# EAGLE schematic mysch (EAGLE 9.3.0)

## Sheet 1 of 3
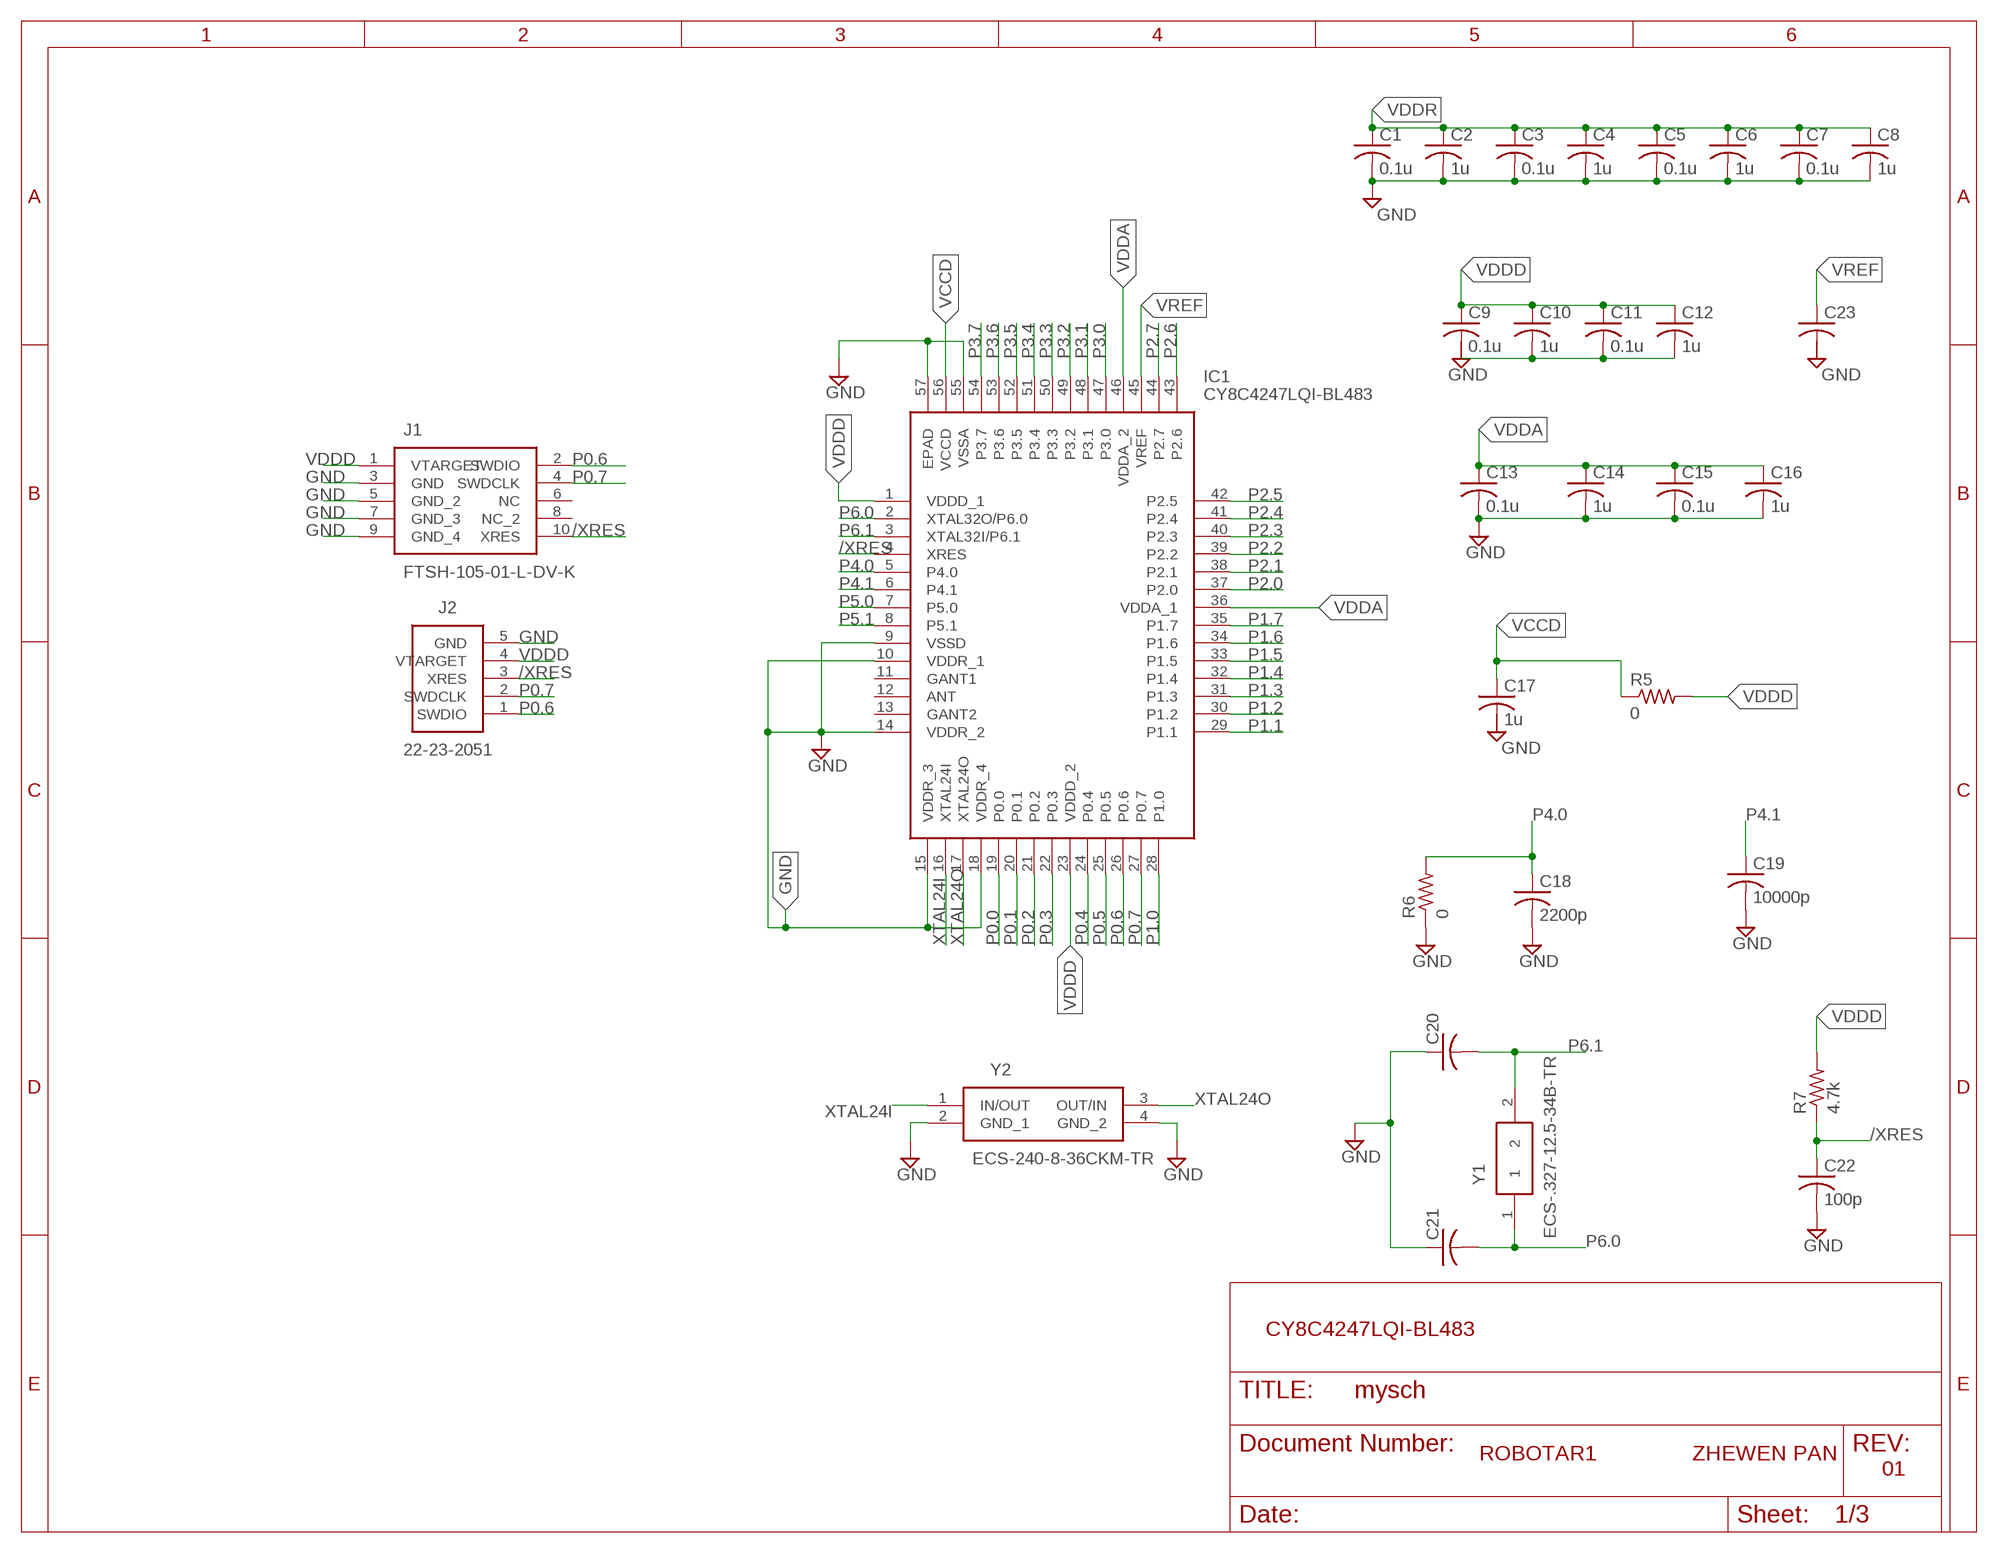
[diagram p0: schematic, sheet 1]

### Parts
C1  0.1u  C-USC0805  [C0805]
C2  1u  C-USC0805  [C0805]
C3  0.1u  C-USC0805  [C0805]
C4  1u  C-USC0805K  [C0805K]
C5  0.1u  C-USC0805  [C0805]
C6  1u  C-USC0805  [C0805]
C7  0.1u  C-USC0805  [C0805]
C8  1u  C-USC0805  [C0805]
C9  0.1u  C-USC0805K  [C0805K]
C10  1u  C-USC0805  [C0805]
C11  0.1u  C-USC0805  [C0805]
C12  1u  C-USC0805  [C0805]
C13  0.1u  C-USC0805  [C0805]
C14  1u  C-USC0805K  [C0805K]
C15  0.1u  C-USC0805K  [C0805K]
C16  1u  C-USC0805K  [C0805K]
C17  1u  C-USC0805  [C0805]
C18  2200p  C-USC0805  [C0805]
C19  10000p  C-USC0805  [C0805]
C20  C-USC0805  [C0805]
C21  C-USC0805  [C0805]
C22  100p  C-USC0805  [C0805]
C23  C-USC0805  [C0805]
IC1  CY8C4247LQI-BL483  [QFN40P700X700X60-57N]
J1  FTSH-105-01-L-DV-K  [FTSH-105-01-L-DV-K]
J2  22-23-2051  [HDRV5W64P0X254_1X5_1255X635X81]
R5  0  R-US_R0805  [R0805]
R6  0  R-US_R0805  [R0805]
R7  4.7k  R-US_R0805  [R0805]
Y1  ECS-.327-12.5-34B-TR  [ECX-31B]
Y2  ECS-240-8-36CKM-TR  [ECS240836QAESTR]

### Nets
/XRES: C22.1 IC1.4(XRES) J1.10(XRES) J2.3(XRES) R7.1
GND: C1.2 C2.2 C3.2 C4.2 C5.2 C6.2 C7.2 C8.2 C13.2 C14.2 C15.2 C16.2 C18.2 C19.2 C20.1 C21.1 C22.2 IC1.9(VSSD) IC1.10(VDDR_1) IC1.14(VDDR_2) IC1.15(VDDR_3) IC1.18(VDDR_4) IC1.55(VSSA) IC1.57(EPAD) J1.3(GND) J1.5(GND_2) J1.7(GND_3) J1.9(GND_4) J2.5(GND) R6.1 Y2.2(GND_1) Y2.4(GND_2) ; also sheet 2,3
N$10: C9.2 C10.2 C11.2 C12.2
P0.0: IC1.19(P0.0)
P0.1: IC1.20(P0.1)
P0.2: IC1.21(P0.2)
P0.3: IC1.22(P0.3)
P0.4: IC1.24(P0.4)
P0.5: IC1.25(P0.5)
P0.6: IC1.26(P0.6) J1.2(SWDIO) J2.1(SWDIO)
P0.7: IC1.27(P0.7) J1.4(SWDCLK) J2.2(SWDCLK)
P1.0: IC1.28(P1.0) ; also sheet 3
P1.1: IC1.29(P1.1) ; also sheet 3
P1.2: IC1.30(P1.2) ; also sheet 3
P1.3: IC1.31(P1.3)
P1.4: IC1.32(P1.4) ; also sheet 2
P1.5: IC1.33(P1.5) ; also sheet 2
P1.6: IC1.34(P1.6) ; also sheet 2
P1.7: IC1.35(P1.7)
P2.0: IC1.37(P2.0)
P2.1: IC1.38(P2.1)
P2.2: IC1.39(P2.2)
P2.3: IC1.40(P2.3)
P2.4: IC1.41(P2.4)
P2.5: IC1.42(P2.5)
P2.6: IC1.43(P2.6)
P2.7: IC1.44(P2.7)
P3.0: IC1.47(P3.0)
P3.1: IC1.48(P3.1)
P3.2: IC1.49(P3.2)
P3.3: IC1.50(P3.3)
P3.4: IC1.51(P3.4)
P3.5: IC1.52(P3.5)
P3.6: IC1.53(P3.6)
P3.7: IC1.54(P3.7)
P4.0: C18.1 IC1.5(P4.0) R6.2
P4.1: C19.1 IC1.6(P4.1)
P5.0: IC1.7(P5.0)
P5.1: IC1.8(P5.1)
P6.0: C21.2 IC1.2(XTAL32O/P6.0) Y1.1
P6.1: C20.2 IC1.3(XTAL32I/P6.1) Y1.2
VCCD: C17.1 IC1.56(VCCD) R5.1
VDDA: C13.1 C14.1 C15.1 C16.1 IC1.36(VDDA_1) IC1.46(VDDA_2)
VDDD: C9.1 C10.1 C11.1 C12.1 IC1.1(VDDD_1) IC1.23(VDDD_2) J1.1(VTARGET) J2.4(VTARGET) R5.2 R7.2
VDDR: C1.1 C2.1 C3.1 C4.1 C5.1 C6.1 C7.1 C8.1
VREF: C23.1 IC1.45(VREF)
XTAL24I: IC1.16(XTAL24I) Y2.1(IN/OUT)
XTAL24O: IC1.17(XTAL24O) Y2.3(OUT/IN)
Unconnected: C17.2 C23.2 IC1.11(GANT1) IC1.12(ANT) IC1.13(GANT2) J1.6(NC) J1.8(NC_2)

### Notes on the sheet
- CY8C4247LQI-BL483
- ROBOTAR1 | ZHEWEN PAN | 01

## Sheet 2 of 3
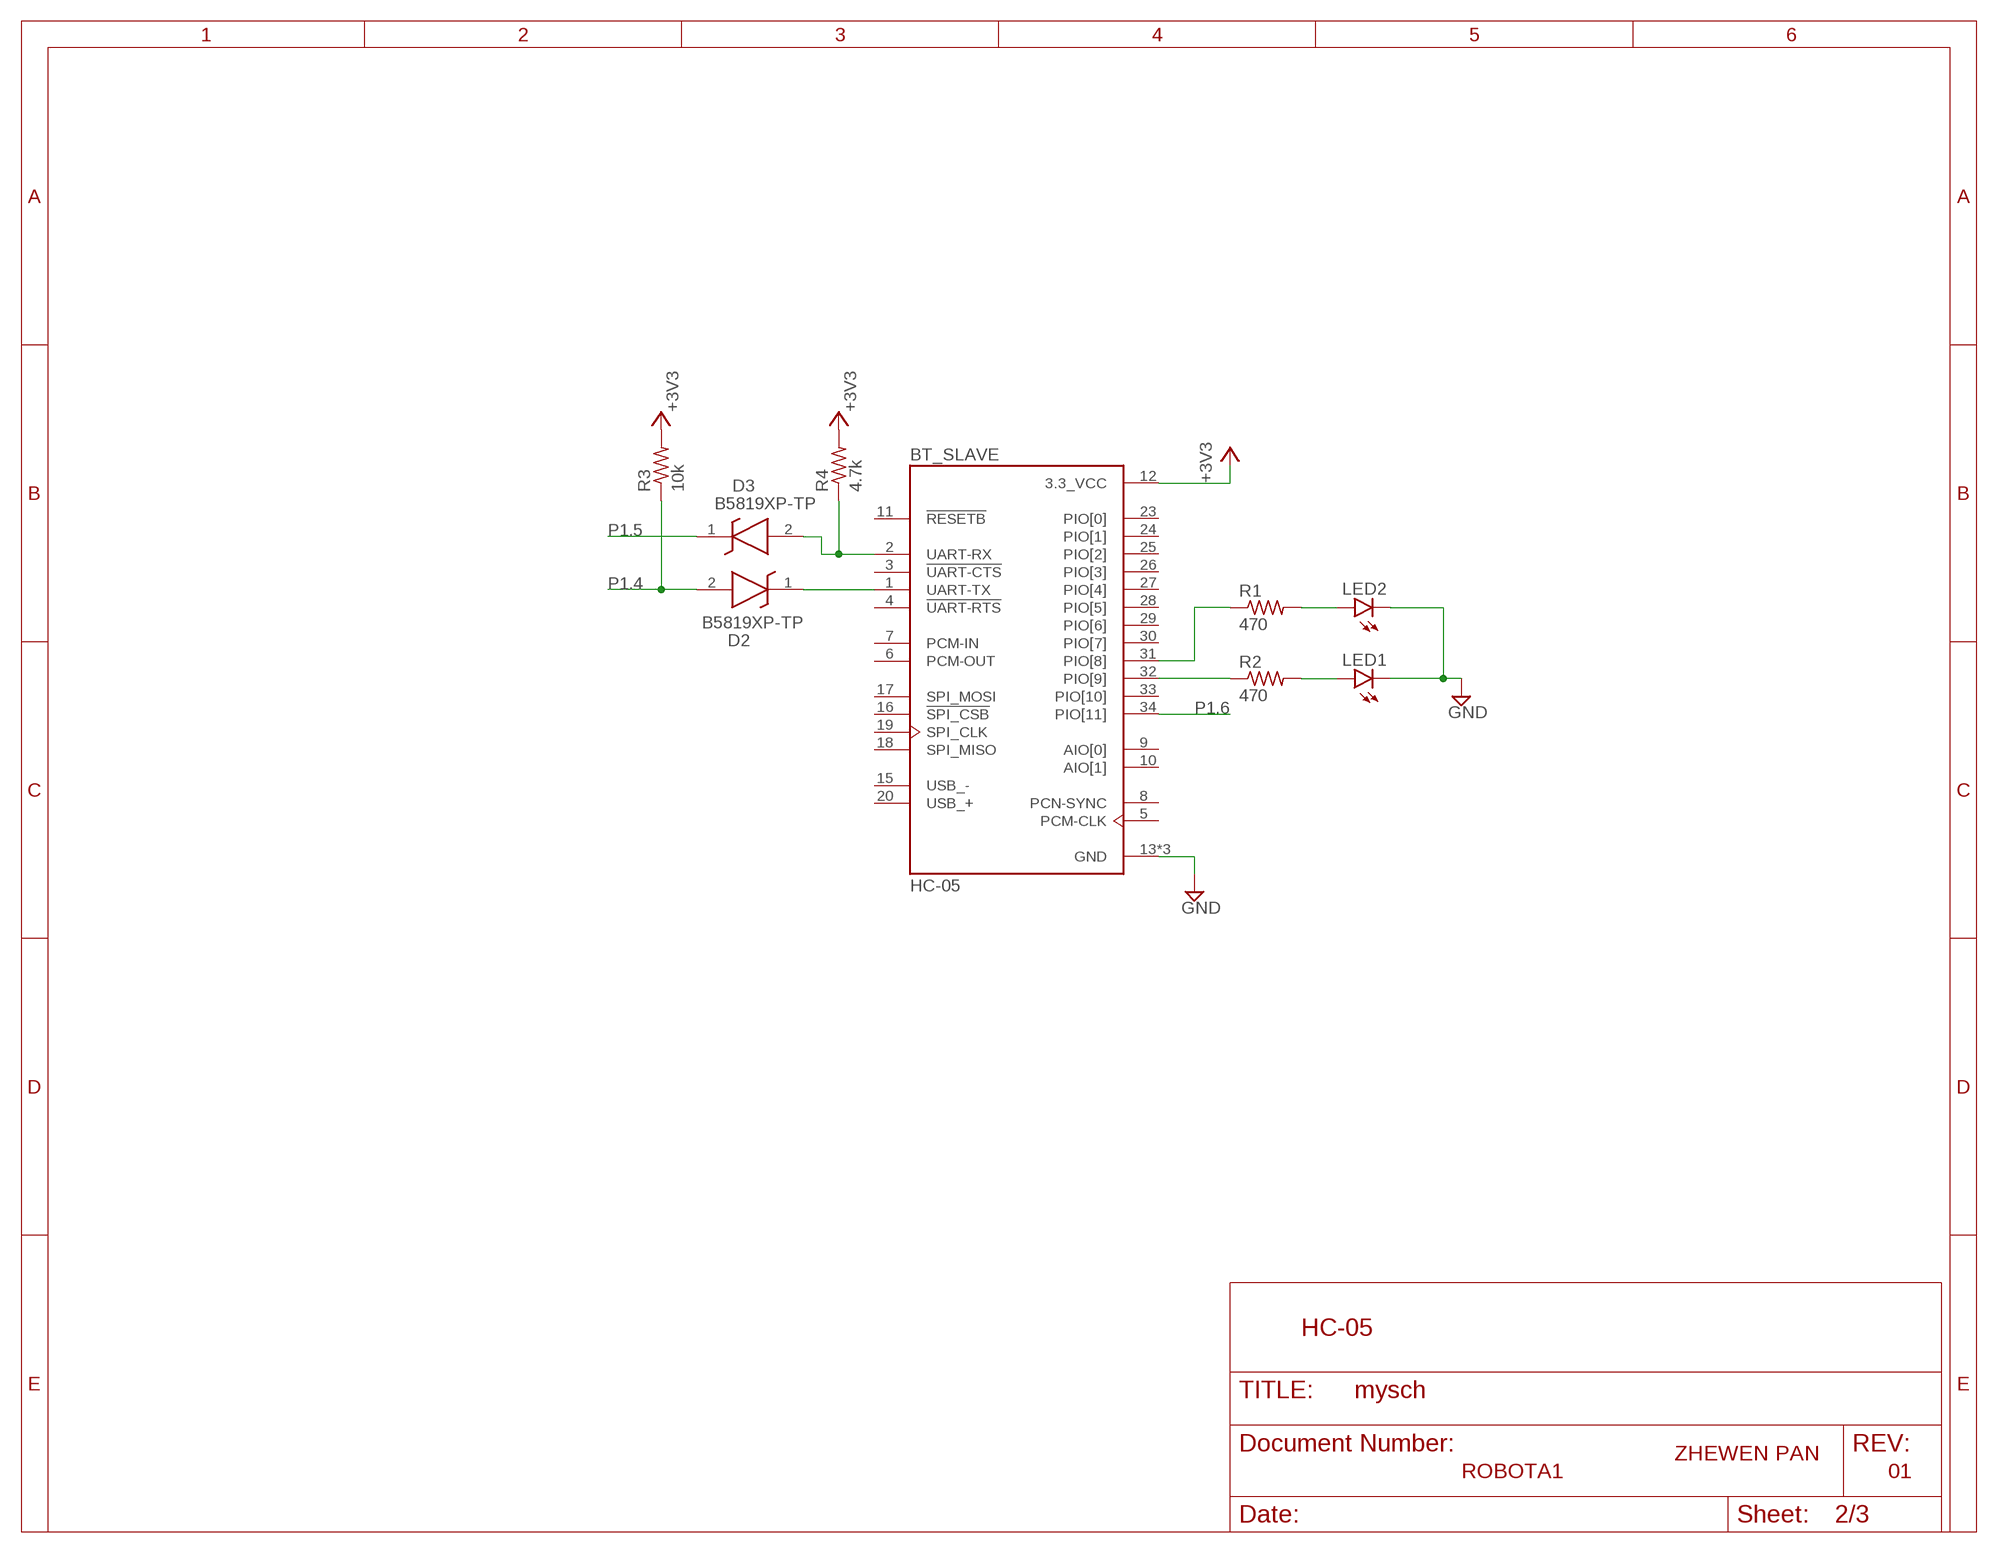
[diagram p1: schematic, sheet 2]

### Parts
BT_SLAVE  HC-05  [XCVR_HC-05]
D2  B5819XP-TP  [B5819XPTP]
D3  B5819XP-TP  [B5819XPTP]
LED1  LEDSML0805  [SML0805]
LED2  LEDSML0805  [SML0805]
R1  470  R-US_R0805  [R0805]
R2  470  R-US_R0805  [R0805]
R3  10k  R-US_R0805  [R0805]
R4  4.7k  R-US_R0805  [R0805]

### Nets
+3V3: BT_SLAVE.12(3.3_VCC) R3.2 R4.2 ; also sheet 3
GND: BT_SLAVE.13(GND) BT_SLAVE.21(GND) BT_SLAVE.22(GND) LED1.C LED2.C ; also sheet 1,3
N$1: BT_SLAVE.1(UART-TX) D2.1(-)
N$2: LED2.A R1.2
N$3: BT_SLAVE.32(PIO[9]) R2.1
N$4: LED1.A R2.2
N$5: BT_SLAVE.31(PIO[8]) R1.1
N$11: BT_SLAVE.2(UART-RX) D3.2(+) R4.1
P1.4: D2.2(+) R3.1 ; also sheet 1
P1.5: D3.1(-) ; also sheet 1
P1.6: BT_SLAVE.34(PIO[11]) ; also sheet 1
Unconnected: BT_SLAVE.3(!UART-CTS) BT_SLAVE.4(!UART-RTS) BT_SLAVE.5(PCM-CLK) BT_SLAVE.6(PCM-OUT) BT_SLAVE.7(PCM-IN) BT_SLAVE.8(PCN-SYNC) BT_SLAVE.9(AIO[0]) BT_SLAVE.10(AIO[1]) BT_SLAVE.11(!RESETB) BT_SLAVE.15(USB_-) BT_SLAVE.16(!SPI_CSB) BT_SLAVE.17(SPI_MOSI) BT_SLAVE.18(SPI_MISO) BT_SLAVE.19(SPI_CLK) BT_SLAVE.20(USB_+) BT_SLAVE.23(PIO[0]) BT_SLAVE.24(PIO[1]) BT_SLAVE.25(PIO[2]) BT_SLAVE.26(PIO[3]) BT_SLAVE.27(PIO[4]) BT_SLAVE.28(PIO[5]) BT_SLAVE.29(PIO[6]) BT_SLAVE.30(PIO[7]) BT_SLAVE.33(PIO[10])

### Notes on the sheet
- HC-05
- ZHEWEN PAN
- ROBOTA1 | 01

## Sheet 3 of 3
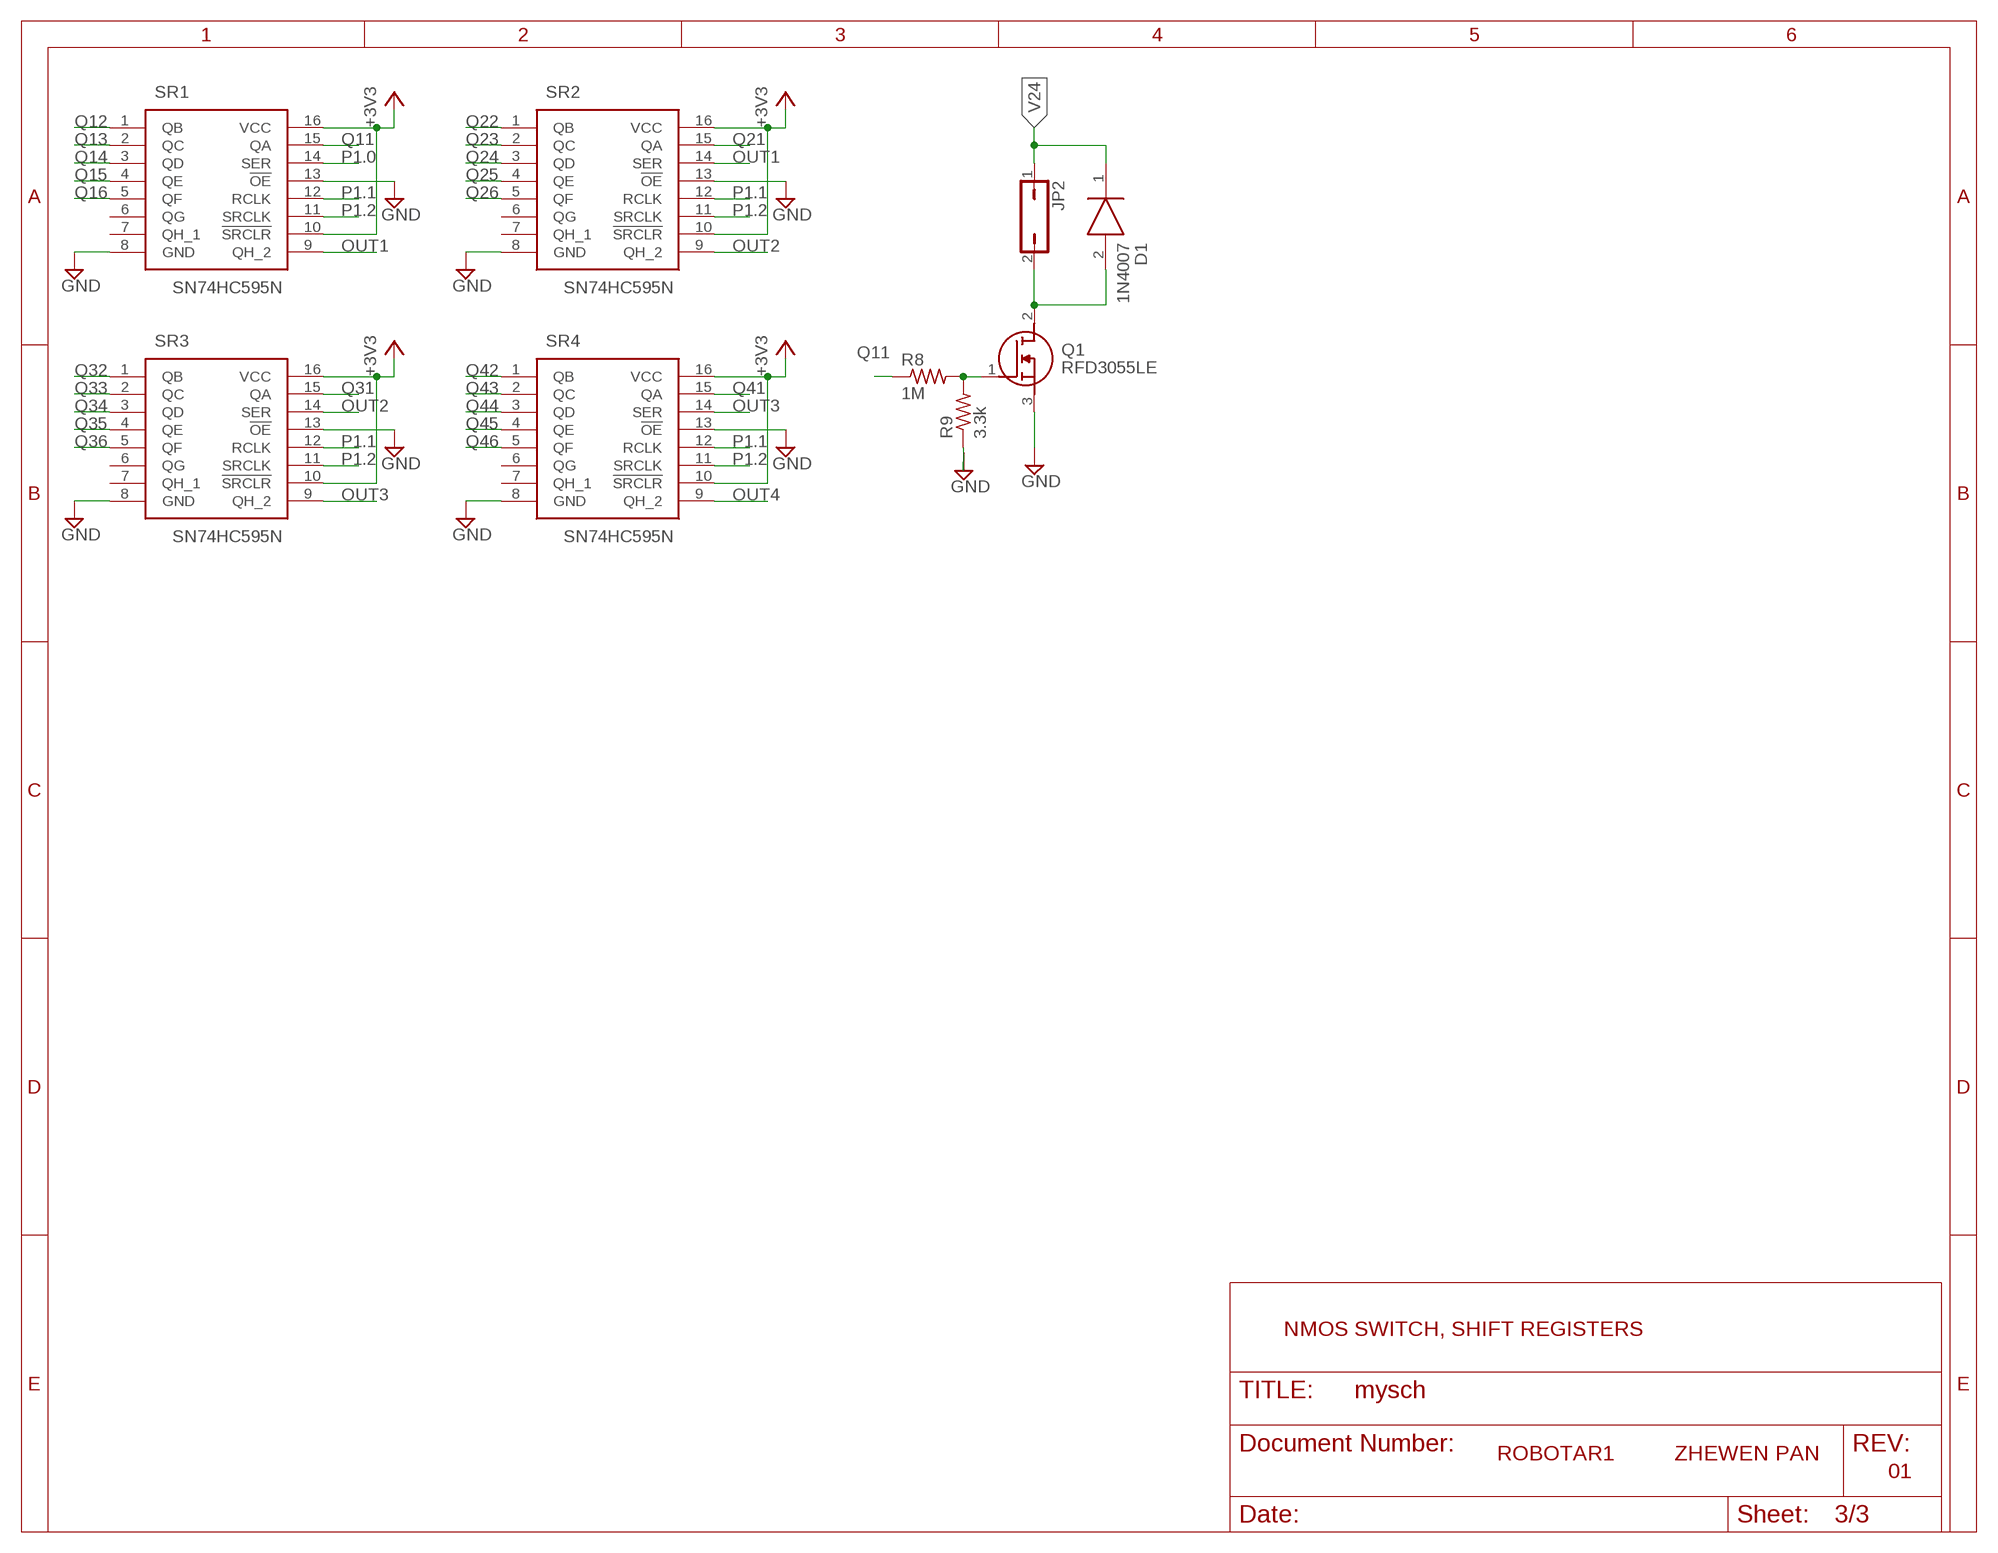
[diagram p2: schematic, sheet 3]

### Parts
D1  1N4007  [DIOAD1410W86L470D235]
JP2  JP1Q  [JP1]
Q1  RFD3055LE  [TO229P250X658X985-3P]
R8  1M  R-US_R0805  [R0805]
R9  3.3k  R-US_R0805  [R0805]
SR1  SN74HC595N  [DIP794W53P254L1930H508Q16N]
SR2  SN74HC595N  [DIP794W53P254L1930H508Q16N]
SR3  SN74HC595N  [DIP794W53P254L1930H508Q16N]
SR4  SN74HC595N  [DIP794W53P254L1930H508Q16N]

### Nets
+3V3: SR1.10(!SRCLR) SR1.16(VCC) SR2.10(!SRCLR) SR2.16(VCC) SR3.10(!SRCLR) SR3.16(VCC) SR4.10(!SRCLR) SR4.16(VCC) ; also sheet 2
GND: Q1.3(S) R9.1 SR1.8(GND) SR1.13(!OE) SR2.8(GND) SR2.13(!OE) SR3.8(GND) SR3.13(!OE) SR4.8(GND) SR4.13(!OE) ; also sheet 1,2
N$6: Q1.1(G) R8.2 R9.2
N$7: D1.2(A) JP2.2 Q1.2(D)
OUT1: SR1.9(QH_2) SR2.14(SER)
OUT2: SR2.9(QH_2) SR3.14(SER)
OUT3: SR3.9(QH_2) SR4.14(SER)
OUT4: SR4.9(QH_2)
P1.0: SR1.14(SER) ; also sheet 1
P1.1: SR1.12(RCLK) SR2.12(RCLK) SR3.12(RCLK) SR4.12(RCLK) ; also sheet 1
P1.2: SR1.11(SRCLK) SR2.11(SRCLK) SR3.11(SRCLK) SR4.11(SRCLK) ; also sheet 1
Q11: R8.1 SR1.15(QA)
Q12: SR1.1(QB)
Q13: SR1.2(QC)
Q14: SR1.3(QD)
Q15: SR1.4(QE)
Q16: SR1.5(QF)
Q21: SR2.15(QA)
Q22: SR2.1(QB)
Q23: SR2.2(QC)
Q24: SR2.3(QD)
Q25: SR2.4(QE)
Q26: SR2.5(QF)
Q31: SR3.15(QA)
Q32: SR3.1(QB)
Q33: SR3.2(QC)
Q34: SR3.3(QD)
Q35: SR3.4(QE)
Q36: SR3.5(QF)
Q41: SR4.15(QA)
Q42: SR4.1(QB)
Q43: SR4.2(QC)
Q44: SR4.3(QD)
Q45: SR4.4(QE)
Q46: SR4.5(QF)
V24: D1.1(K) JP2.1
Unconnected: SR1.6(QG) SR1.7(QH_1) SR2.6(QG) SR2.7(QH_1) SR3.6(QG) SR3.7(QH_1) SR4.6(QG) SR4.7(QH_1)

### Notes on the sheet
- NMOS SWITCH, SHIFT REGISTERS
- ROBOTAR1 | ZHEWEN PAN
- 01

## Library data of the parts
BT_SLAVE = HC-05:HC-05: Bluetooth to Serial Port Module; AVAILABILITY: Unavailable; MF: Texas Instruments; MP: HC-05; PACKAGE: SOIC-14; PRICE: None; SPICEPREFIX: X
C1-C23 = rcl:C-US: CAPACITOR, American symbol; SPICEPREFIX: C
D1 = SamacSys_Parts:1N4007: MULTICOMP - 1N4007 - DIODE, STANDARD, 1A, 1000V,DO-41 Source: Datasheet; DESCRIPTION: MULTICOMP - 1N4007 - DIODE, STANDARD, 1A, 1000V,DO-41; HEIGHT: mm; MANUFACTURER_NAME: MULTICOMP; MANUFACTURER_PART_NUMBER: 1N4007
D2 D3 = SamacSys_Parts:B5819XP-TP: Schottky Diodes & Rectifiers 1A,40V,Schottky,FBP-02L Package Source: Datasheet <http://www.mccsemi.com/up_pdf/B5819XP(FBP-02L)-B.pdf>; DESCRIPTION: Schottky Diodes & Rectifiers 1A,40V,Schottky,FBP-02L Package; HEIGHT: 0.55mm; MANUFACTURER_NAME: Micro Commercial Components (MCC); MANUFACTURER_PART_NUMBER: B5819XP-TP
IC1 = cy_mcu:CY8C4247LQI-BL483: CYPRESS SEMICONDUCTOR - CY8C4247LQI-BL483 - MCU, 32BIT, CORTEX-M0, 48MHZ, QFN-56 Source: Datasheet <http://uk.rs-online.com/web/p/products/1242964P>; DESCRIPTION: CYPRESS SEMICONDUCTOR - CY8C4247LQI-BL483 - MCU, 32BIT, CORTEX-M0, 48MHZ, QFN-56; HEIGHT: 0.6mm; MANUFACTURER_NAME: Cypress Semiconductor; MANUFACTURER_PART_NUMBER: CY8C4247LQI-BL483; RS_PART_NUMBER: 1242964P; RS_PRICE-STOCK: http://uk.rs-online.com/web/p/products/1242964P
J1 = SamacSys_Parts:FTSH-105-01-L-DV-K: SMT Micro Header, 10 position, 2-row Source: Datasheet <http://suddendocs.samtec.com/catalog_english/ftsh_smt.pdf>; DESCRIPTION: SMT Micro Header, 10 position, 2-row; HEIGHT: mm; MANUFACTURER_NAME: SAMTEC; MANUFACTURER_PART_NUMBER: FTSH-105-01-L-DV-K; RS_PART_NUMBER: 1592332; RS_PRICE-STOCK: https://uk.rs-online.com/web/p/products/1592332
J2 = SamacSys_Parts:22-23-2051: Headers & Wire Housings VERT PCB HDR 5P TIN FRICTION LOCK Source: Datasheet <http://uk.rs-online.com/web/p/products/1888757>; ALLIED_NUMBER: 70190811; DESCRIPTION: Headers & Wire Housings VERT PCB HDR 5P TIN FRICTION LOCK; HEIGHT: 8.18mm; MANUFACTURER_NAME: Molex; MANUFACTURER_PART_NUMBER: 22-23-2051; RS_PART_NUMBER: 1888757; RS_PRICE-STOCK: http://uk.rs-online.com/web/p/products/1888757
JP2 = jumper:JP1Q: JUMPER
LED1 LED2 = led:LED: LED OSRAM: - CHIPLED LG R971, LG N971, LY N971, LG Q971, LY Q971, LO R971, LY R971 LH N974, LH R974 LS Q976, LO Q976, LY Q976 LO Q996 - Hyper CHIPLED LW Q18S LB Q993, LB Q99A, LB R99A - SideLED LS A670, LO A670, LY A670, LG A670, LP A670 LB A673, LV A673, LT A673, LW A673 LH A674 LY A675 LS A676, LA A676, LO A676, LY A676, LW A676 LS A679, LY A679, LG A679 - Hyper Micro SIDELED® LS Y876, LA Y876, LO Y876, LY Y876 LT Y87S - SmartLED LW L88C, LW L88S LB L89C, LB L89S, LG L890 LS L89K, LO L89K, LY L89K LS L896, LA L896, LO L896, LY L896 - TOPLED LS T670, LO T670, LY T670, LG T670, LP T670 LSG T670, LSP T670, LSY T670, LOP T670, LYG T670 LG T671, LOG T671, LSG T671 LB T673, LV T673, LT T673, LW T673 LH T674 LS T676, LA T676, LO T676, LY T676, LB T676, LH T676, LSB T676, LW T676 LB T67C, LV T67C, LT T67C, LS T67K, LO T67K, LY T67K, LW E67C LS E67B, LA E67B, LO E67B, LY E67B, LB E67C, LV E67C, LT E67C LW T67C LS T679, LY T679, LG T679 LS T770, LO T770, LY T770, LG T770, LP T770 LB T773, LV T773, LT T773, LW T773 LH T774 LS E675, LA E675, LY E675, LS T675 LS T776, LA T776, LO T776, LY T776, LB T776 LHGB T686 LT T68C, LB T68C - Hyper Mini TOPLED® LB M676 - Mini TOPLED Santana® LG M470 LS M47K, LO M47K, LY M47K Source: http://www.osram.convergy.de LUXEON: - LUMILED® LXK2-PW12-R00, LXK2-PW12-S00, LXK2-PW14-U00, LXK2-PW14-V00 LXK2-PM12-R00, LXK2-PM12-S00, LXK2-PM14-U00 LXK2-PE12-Q00, LXK2-PE12-R00, LXK2-PE12-S00, LXK2-PE14-T00, LXK2-PE14-U00 LXK2-PB12-K00, LXK2-PB12-L00, LXK2-PB12-M00, LXK2-PB14-N00, LXK2-PB14-P00, LXK2-PB14-Q00 LXK2-PR12-L00, LXK2-PR12-M00, LXK2-PR14-Q00, LXK2-PR14-R00 LXK2-PD12-Q00, LXK2-PD12-R00, LXK2-PD12-S00 LXK2-PH12-R00, LXK2-PH12-S00 LXK2-PL12-P00, LXK2-PL12-Q00, LXK2-PL12-R00 Source: www.luxeon.com KINGBRIGHT: KA-3528ASYC Source: www.kingbright.com
Q1 = SamacSys_Parts:RFD3055LE: ON SEMICONDUCTOR - RFD3055LE - MOSFET, N-CH, 60V, 11A, TO-251AA-3 Source: Datasheet <https://www.onsemi.com/pub/Collateral/RFD3055LESM-D.pdf>; DESCRIPTION: ON SEMICONDUCTOR - RFD3055LE - MOSFET, N-CH, 60V, 11A, TO-251AA-3; HEIGHT: 2.5mm; MANUFACTURER_NAME: ON Semiconductor; MANUFACTURER_PART_NUMBER: RFD3055LE
R1-R9 = rcl:R-US_: RESISTOR, American symbol; SPICEPREFIX: R
SR1-SR4 = SamacSys_Parts:SN74HC595N: 8-Bit Shift Registers With 3-State Output Registers Source: Datasheet <http://uk.rs-online.com/web/p/products/2175695P>; DESCRIPTION: 8-Bit Shift Registers With 3-State Output Registers; HEIGHT: 5.08mm; MANUFACTURER_NAME: Texas Instruments; MANUFACTURER_PART_NUMBER: SN74HC595N; RS_PART_NUMBER: 2175695P; RS_PRICE-STOCK: http://uk.rs-online.com/web/p/products/2175695P
Y1 = SamacSys_Parts:ECS-.327-12.5-34B-TR: Crystals 32.768KHz 20ppm 12.5pF -40C +85C Source: Datasheet; DESCRIPTION: Crystals 32.768KHz 20ppm 12.5pF -40C +85C; HEIGHT: mm; MANUFACTURER_NAME: ECS; MANUFACTURER_PART_NUMBER: ECS-.327-12.5-34B-TR
Y2 = SamacSys_Parts:ECS-240-8-36CKM-TR: Crystals 24MHz 10ppm Source: Datasheet; DESCRIPTION: Crystals 24MHz 10ppm; HEIGHT: 0mm; MANUFACTURER_NAME: ECS; MANUFACTURER_PART_NUMBER: ECS-240-8-36CKM-TR